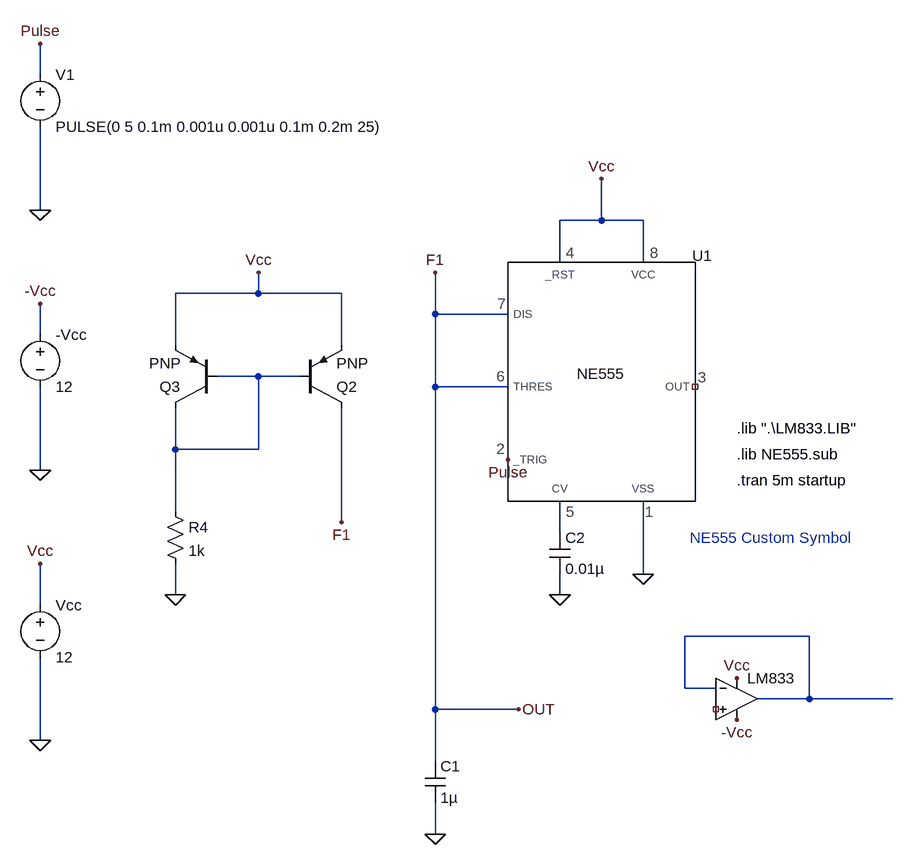
[diagram p0: schematic NE555 Ramp Generator.asc]
NE555 Ramp Generator.asc, the LTspice schematic file:
Version 4
SHEET 1 1960 948
WIRE 128 -384 128 -432
WIRE 128 -176 128 -304
WIRE 992 -160 992 -224
WIRE 992 -160 928 -160
WIRE 1056 -160 992 -160
WIRE 928 -96 928 -160
WIRE 1056 -96 1056 -160
WIRE 464 -48 464 -80
WIRE 464 -48 336 -48
WIRE 592 -48 464 -48
WIRE 736 -16 736 -80
WIRE 848 -16 736 -16
WIRE 128 16 128 -32
WIRE 336 32 336 -48
WIRE 592 32 592 -48
WIRE 464 80 400 80
WIRE 528 80 464 80
WIRE 736 96 736 -16
WIRE 848 96 736 96
WIRE 336 192 336 128
WIRE 464 192 464 80
WIRE 464 192 336 192
WIRE 128 224 128 96
WIRE 336 288 336 192
WIRE 592 304 592 128
WIRE 928 320 928 272
WIRE 1056 384 1056 272
WIRE 336 416 336 368
WIRE 928 416 928 384
WIRE 128 432 128 368
WIRE 1312 480 1120 480
WIRE 1120 560 1120 480
WIRE 1168 560 1120 560
WIRE 1312 576 1312 480
WIRE 1312 576 1232 576
WIRE 1440 576 1312 576
WIRE 736 592 736 96
WIRE 864 592 736 592
WIRE 128 640 128 512
WIRE 736 672 736 592
WIRE 736 784 736 736
FLAG 864 592 OUT
FLAG 1056 384 0
FLAG 736 784 0
FLAG 128 640 0
FLAG 128 368 Vcc
FLAG 1200 544 Vcc
FLAG 128 -32 -Vcc
FLAG 128 224 0
FLAG 1200 608 -Vcc
FLAG 992 -224 Vcc
FLAG 336 416 0
FLAG 464 -80 Vcc
FLAG 592 304 F1
FLAG 736 -80 F1
FLAG 928 416 0
FLAG 128 -432 Pulse
FLAG 128 -176 0
FLAG 848 208 Pulse
SYMBOL cap 720 672 R0
SYMATTR InstName C1
SYMATTR Value 1µ
SYMBOL NE555-1 848 -16 R0
SYMATTR InstName U1
SYMBOL voltage 128 416 R0
WINDOW 123 0 0 Left 0
WINDOW 39 0 0 Left 0
SYMATTR InstName Vcc
SYMATTR Value 12
SYMBOL voltage 128 0 R0
WINDOW 123 0 0 Left 0
WINDOW 39 0 0 Left 0
SYMATTR InstName -Vcc
SYMATTR Value 12
SYMBOL res 320 272 R0
SYMATTR InstName R4
SYMATTR Value 1k
SYMBOL pnp 528 128 M180
SYMATTR InstName Q2
SYMBOL pnp 400 128 R180
SYMATTR InstName Q3
SYMBOL Opamps\\UniversalOpamp2 1200 576 R0
SYMATTR InstName LM833
SYMBOL cap 912 320 R0
SYMATTR InstName C2
SYMATTR Value 0.01µ
SYMBOL voltage 128 -400 R0
WINDOW 123 0 0 Left 0
WINDOW 39 0 0 Left 0
SYMATTR InstName V1
SYMATTR Value PULSE(0 5 0.1m 0.001u 0.001u 0.1m 0.2m 25)
TEXT 1200 240 Left 2 !.tran 5m startup
TEXT 1200 200 Left 2 !.lib NE555.sub
TEXT 1128 328 Left 2 ;NE555 Custom Symbol
TEXT 1200 160 Left 2 !.lib ".\\LM833.LIB"

The netlist it stands for:
* NE555 Ramp Generator.asc
C1 F1 0 1µ
XU1 0 Pulse NC_01 Vcc N002 F1 F1 Vcc NE555  ; pins VSS _TRIG OUT _RST CV THRES DIS VCC
Vcc Vcc 0 12
V§-Vcc -Vcc 0 12
R4 N001 0 1k
Q2 F1 N001 Vcc 0 PNP
Q3 N001 N001 Vcc 0 PNP
XLM833 NC_02 N003 Vcc -Vcc N003 level.2 Avol=1Meg GBW=10Meg Slew=10Meg ilimit=25m rail=0 Vos=0 phimargin=45 en=0 enk=0 in=0 ink=0 Rin=500Meg  ; pins IN+ IN- V+ V- OUT
C2 N002 0 0.01µ
V1 Pulse 0 PULSE(0 5 0.1m 0.001u 0.001u 0.1m 0.2m 25)
.model NPN NPN
.model PNP PNP
.lib standard.bjt
.tran 5m startup
.lib NE555.sub
* NE555 Custom Symbol
.lib ".\LM833.LIB"
.lib UniversalOpamps2.sub
.backanno
.end